# EAGLE design Monitor (EAGLE 9.6.2)
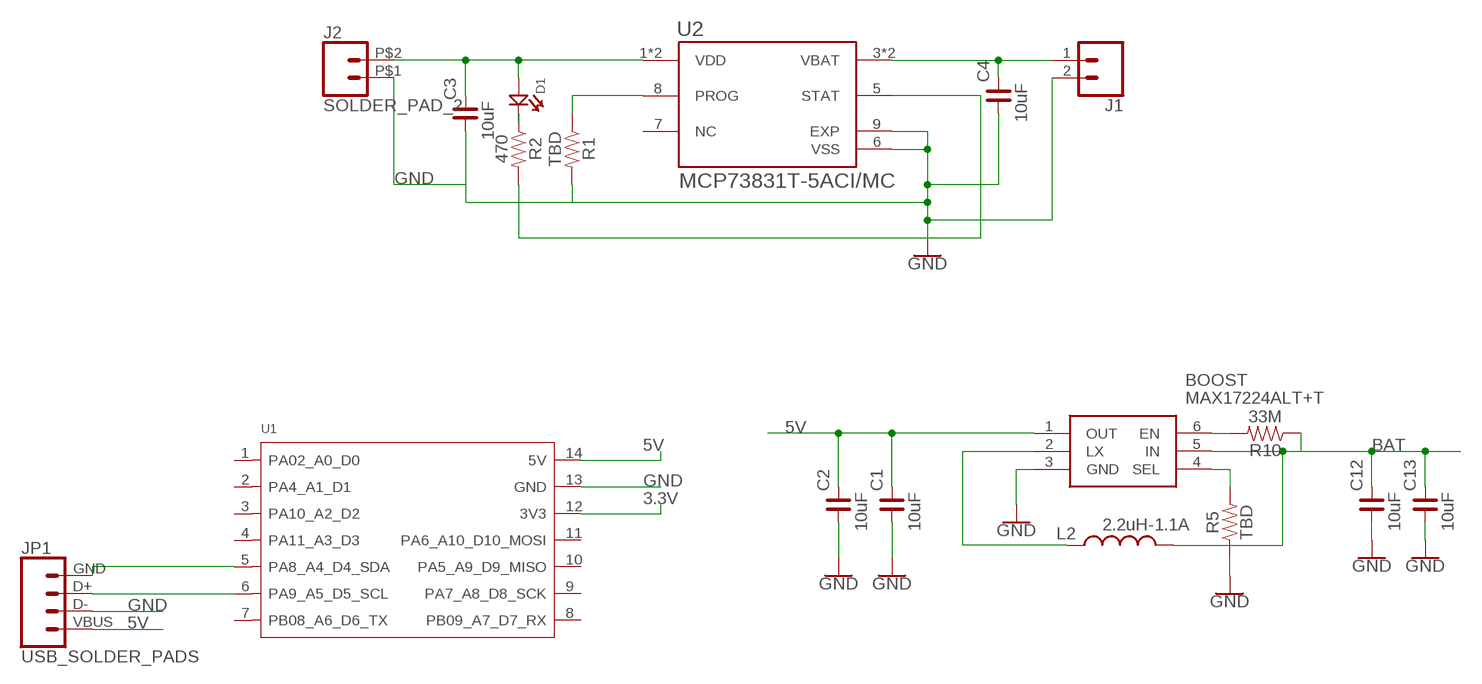
[diagram p0: schematic, sheet 1]

## Parts
BOOST  MAX17224ALT+T  [MAX17220ALT]
C1  10uF  C_0805  [C0805]
C2  10uF  C_0805  [C0805]
C3  10uF  C_0805  [C0805]
C4  10uF  C_0805  [C0805]
C12  10uF  C_0805  [C0805]
C13  10uF  C_0805  [C0805]
D1  LED0603  [LED-0603]
J1  CONN_021X02_NO_SILK  [1X02_NO_SILK]
J2  SOLDER_PAD_2  [SOLDER_PAD_2]
JP1  USB_SOLDER_PADS  [USB-SOLDER-PADS]
L2  2.2uH-1.1A  L3.9X3.9_10UH_0.55A  [LPS4012]
R1  TBD  2.2KOHM-0603-1/10W-1%  [0603]
R2  470  2.2KOHM-0603-1/10W-1%  [0603]
R5  TBD  2.2KOHM-0603-1/10W-1%  [0603]
R10  33M  2.2KOHM-0603-1/10W-1%  [0603]
U1  MOUDLE-SEEEDUINO-XIAO  [MOUDLE14P-2.54-21X17.8MM]
U2  MCP73831T-5ACI/MC  [SON50P200X300X100-9N]

## Nets
3.3V: U1.12(3V3)
5V: BOOST.1(OUT) C1.2 C2.2 JP1.VBUS U1.14(5V)
BAT: BOOST.5(IN) C12.2 C13.2 L2.2 R10.1
GND: BOOST.3(GND) C1.1 C2.1 C3.1 C4.1 C12.1 C13.1 J1.2 J2.P$1 JP1.D- R1.2 R5.1 U1.13(GND) U2.6(VSS) U2.9(EXP)
N$1: JP1.GND U1.5(PA8_A4_D4_SDA)
N$2: JP1.D+ U1.6(PA9_A5_D5_SCL)
N$3: C4.2 J1.1 U2.3(VBAT) U2.4(VBAT)
N$4: R1.1 U2.8(PROG)
N$5: C3.2 D1.+ J2.P$2 U2.1(VDD) U2.2(VDD)
N$6: D1.- R2.1
N$7: R2.2 U2.5(STAT)
N$10: BOOST.6(EN) R10.2
N$15: BOOST.2(LX) L2.1
N$16: BOOST.4(SEL) R5.2
Unconnected: U1.1(PA02_A0_D0) U1.2(PA4_A1_D1) U1.3(PA10_A2_D2) U1.4(PA11_A3_D3) U1.7(PB08_A6_D6_TX) U1.8(PB09_A7_D7_RX) U1.9(PA7_A8_D8_SCK) U1.10(PA5_A9_D9_MISO) U1.11(PA6_A10_D10_MOSI) U2.7(NC)

## Library data of the parts
BOOST = SamacSys_Parts:MAX17224ALT+T: Switching Voltage Regulators 0.9V to 5V, 500mA Input Current Limit Ultra Low Power Boost Converter with True Shutdown Source: Datasheet <https://datasheets.maximintegrated.com/en/ds/MAX17220-MAX17225.pdf>; DESCRIPTION: Switching Voltage Regulators 0.9V to 5V, 500mA Input Current Limit Ultra Low Power Boost Converter with True Shutdown; HEIGHT: 0.8mm; MANUFACTURER_NAME: Maxim Integrated; MANUFACTURER_PART_NUMBER: MAX17224ALT+T; MOUSER_PART_NUMBER: 700-MAX17224ALT+T; MOUSER_PRICE-STOCK: https://www.mouser.co.uk/ProductDetail/Maxim-Integrated/MAX17224ALT%2bT?qs=%252B6g0mu59x7JmjkzdhtIl5Q%3D%3D
C1-C4 C12 C13 = rc-master-smd:C_: NON-POLARIZED CAP
D1 = RAK3172-Breakout:LED
J1 = SparkFun-Connectors:CONN_02: Multi connection point. Often used as Generic Header-pin footprint for 0.1 inch spaced/style header connections On any of the 0.1 inch spaced packages, you can populate with these: Break Away Headers - Straight <https://www.sparkfun.com/products/116> (PRT-00116) Break Away Male Headers - Right Angle <https://www.sparkfun.com/products/553> (PRT-00553) Female Headers <https://www.sparkfun.com/products/115> (PRT-00115) Break Away Headers - Machine Pin <https://www.sparkfun.com/products/117> (PRT-00117) Break Away Female Headers - Swiss Machine Pin <https://www.sparkfun.com/products/743> (PRT-00743) For SCREWTERMINALS and SPRING TERMINALS visit here: Screw Terimnals on SparkFun.com <https://www.sparkfun.com/search/results?term=Screw+Terminals> (5mm/3.5mm/2.54mm spacing) This device is also useful as a general connection point to wire up your design to another part of your project. Our various solder wires solder well into these plated through hole pads. Hook-Up Wire - Assortment (Stranded, 22 AWG) <https://www.sparkfun.com/products/11375> (PRT-11375) Hook-Up Wire - Assortment (Solid Core, 22 AWG) <https://www.sparkfun.com/products/11367> (PRT-11367) View the entire wire category on our website here <https://www.sparkfun.com/categories/141> Special notes: Molex polarized connector foot print use with: PRT-08233 with associated crimp pins and housings. 2.54_SCREWTERM for use with PRT-10571. 3.5mm Screw Terminal footprints for PRT-08084 5mm Screw Terminal footprints for use with PRT-08432
J2 = SparkFun-Connectors:SOLDER_PAD_2: Solder Pad for LuMini Rings
JP1 = SparkFun-Connectors:USB_SOLDER_PADS: Solder pad access to USB pins. Helpful to expose on PCBs so user can attach external USB connector if necessary.
L2 = TSEM:L: Inductor; FARNELL_OC: 2408076; MF: BOURNS; MPN: SRN2009T-100M; OC_NEWARK: 43AC9502; VALUE: 10uH-0.55A
R1 R2 R5 R10 = SparkFun-Resistors:2.2KOHM: 2.2kΩ resistor A resistor is a passive two-terminal electrical component that implements electrical resistance as a circuit element. Resistors act to reduce current flow, and, at the same time, act to lower voltage levels within circuits. - Wikipedia; PROD_ID: RES-08272; VALUE: 2.2k
U1 = Seeeduino XIAO:MOUDLE-SEEEDUINO-XIAO
U2 = MCP73831T-5ACI_MC:MCP73831T-5ACI/MC: Check availability <https://pricing.snapeda.com/parts/MCP73831T5ACIMC/Microchip%20Technology/view-part?ref=eda>; AVAILABILITY: Not in stock; DESCRIPTION: Tiny Integrated Li-Ion/Li-Poly Charge mgnt controller, 4.5V Vreg out; MF: Microchip Technology; MP: MCP73831T5ACIMC; PACKAGE: None; PRICE: None

## Board
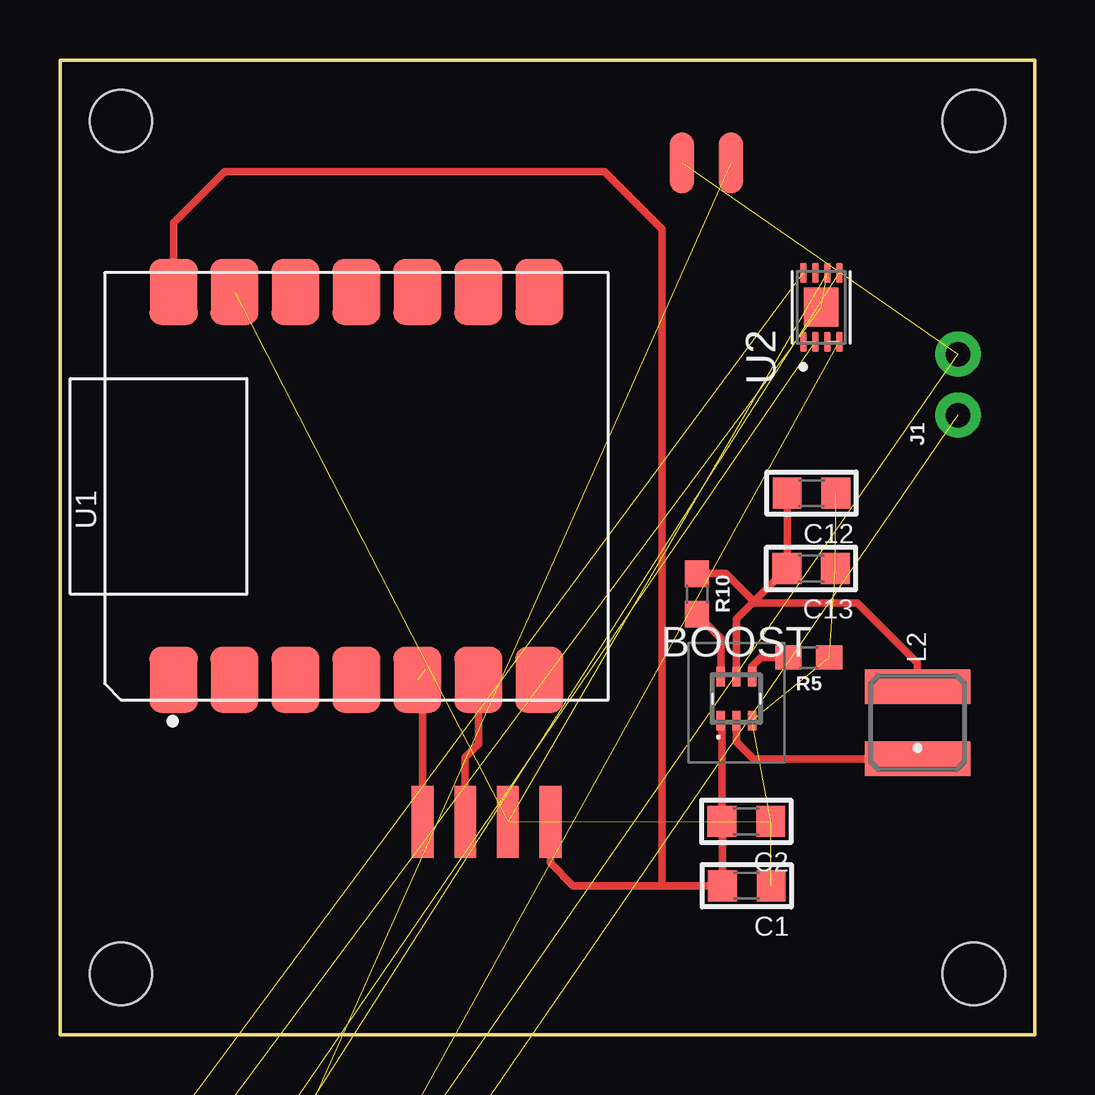
[diagram p1: board, top side]

Size 40.64 x 40.64 mm. Coordinates in mm from the lower left corner, seen from the top.
Outline: 0,40.64 40.64,40.64 40.64,0 0,0 0,40.64
Copper layers (1*16): Top 0.035mm / dielectric 1.5mm / Bottom 0.035mm
Design rules "default": minimum track width 6mil, minimum drill 0.35mm, track to track 6mil, track to pad 6mil, pad to pad 6mil, via to via 6mil, smd to smd 6mil, copper to edge 40mil, drill to drill 6mil, minimum pad ring 10mil, minimum via ring 8mil, stop-mask expansion 4mil, vias tented up to drill 0mil, thermal gap 10mil
Holes 2.6 mm at 2.54,2.54 2.54,38.1 38.1,38.1 38.1,2.54

### Footprints (pad centres in the part's own frame; a part is rotated, then mirrored left to right if it is on the bottom)
MAX17220ALT = smd 0.35 x 0.8: 1 -0.65,-0.915; 2 0,-0.915; 3 0.65,-0.915; 4 0.65,0.915; 5 0,0.915; 6 -0.65,0.915
C0805 = smd 1.2 x 1.3: 1 -1.016,0; 2 1.016,0
LED-0603 = smd 0.762 x 0.889: + 0.762,0; - -0.762,0
1X02_NO_SILK = drill 1.016 pad 1.88: 1 0,0; 2 2.54,0
SOLDER_PAD_2 = smd 1.016 x 2.54: P$1 -1.016,0; P$2 1.016,0
USB-SOLDER-PADS = smd 3 x 0.9: D+ 0,-0.889; D- 0,0.889; GND 0,-2.667; VBUS 0,2.667
LPS4012 = smd 1.45 x 4.4: 1 -1.5,0; 2 1.5,0
0603 = smd 1.1 x 1: 1 -0.85,0; 2 0.85,0
MOUDLE14P-2.54-21X17.8MM = smd 2.75 x 2: 1 0.835,18.12; 2 0.835,15.58; 3 0.835,13.04; 4 0.835,10.5; 5 0.835,7.96; 6 0.835,5.42; 7 0.835,2.88; 8 17,2.88; 9 17,5.42; 10 17,7.96; 11 17,10.5; 12 17,13.04; 13 17,15.58; 14 17,18.12
SON50P200X300X100-9N = smd 0.84 x 0.27: 1 -1.435,0.75; 2 -1.435,0.25; 3 -1.435,-0.25; 4 -1.435,-0.75; 5 1.435,-0.75; 6 1.435,-0.25; 7 1.435,0.25; 8 1.435,0.75 | smd 1.63 x 1.43: 9 0,0

### Placement (x,y rotation side)
BOOST  28.2,14.02 0 top
C1  28.63,6.22 180 top
C2  28.61,8.9 180 top
C3  2.21,-19.23 0 top  (outside the outline)
C4  2.21,-23.96 0 top  (outside the outline)
C12  31.33,22.58 180 top
C13  31.31,19.44 180 top
D1  2.34,-12.53 0 top  (outside the outline)
J1  37.44,25.83 90 top
J2  26.95,36.35 0 top
JP1  17.78,8.89 270 top
L2  35.75,13.01 90 top
R1  1.69,-8.92 0 top  (outside the outline)
R2  1.69,-15.22 0 top  (outside the outline)
R5  31.21,15.73 180 top
R10  26.55,18.38 270 top
U1  22.86,13.97 90 top
U2  31.74,30.33 90 top

### Tracks (layer width: path | path; a pad name or v marks a point on that pad's centre or on a via)
5V
  Top 0.305: BOOST.1 27.6,13.05 C2.2 27.61,8.88 C1.2 25.09,6.22 | 25.09,6.22 21.4,6.22 20.45,7.17 JP1.VBUS | 25.09,6.22 25.09,33.58 22.69,35.98 6.86,35.98 4.74,33.86 U1.14
BAT
  Top 0.305: C12.2 30.31,19.46 C13.2 28.92,18.07 | 28.92,18.07 28.86,18.01 | 28.86,18.01 28.2,17.34 BOOST.5 | R10.1 27.75,19.23 28.92,18.07 | L2.2 35.75,15.5 33.24,18.01 28.86,18.01
GND  (14 unrouted)
N$1  (1 unrouted)
  Top 0.305: JP1.GND 15.11,13.84 15.24,13.97 15.24,15.24
N$2
  Top 0.305: JP1.D+ 16.89,11.56 17.46,12.12 17.46,14.79 U1.6
N$3  (3 unrouted)
N$4  (1 unrouted)
N$5  (4 unrouted)
N$6  (1 unrouted)
N$7  (1 unrouted)
N$10
  Top 0.305: R10.2 27.55,16.53 BOOST.6
N$15
  Top 0.305: BOOST.2 28.2,12.22 28.9,11.51 L2.1
N$16
  Top 0.305: BOOST.4 28.85,15.35 29.22,15.73 R5.2